# Altium schematic sheet AMU-S07-V00-AMSShutdown.SchDoc: Alarm Relay
size A3; DrawnBy: Thomas Benedetti; DocumentNumber: 7; SheetNumber: 7; SheetTotal: 25; Version: 00; Project: AMU 2020; PageSetup: Record=PageOptions|CenterHorizontal=True|CenterVertical=True|PrintScale=0.97|XCorrection=1.00|YCorrection=1.00|PrintKind=0|BorderSize=5000000|LeftOffset=0|BottomOffset=0|Orientation=2|PaperLength=1000|PaperWidth=1000|Scale=100|PaperSource=7|PrintQuality=-4|MediaType=1|DitherType=10|PaperKind=A4|PrintScaleMode=1
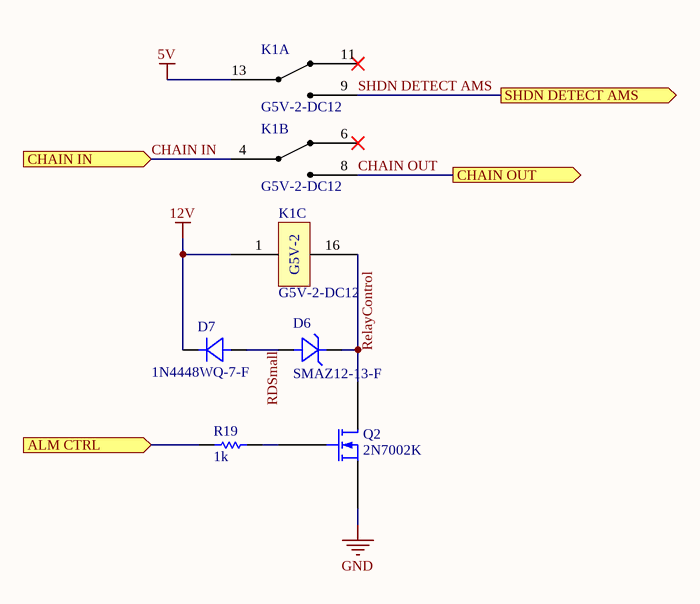
[diagram p0: AMU-S07-V00-AMSShutdown.SchDoc]

## Parts
D6  SMAZ12-13-F  [SMA]
D7  1N4448WQ-7-F  [SMA]
K1  G5V-2-DC12  [G5V-2]  (parts A,B,C of 3)
Q2  2N7002K  [SOT-23-3]
R19  1k  [Res_ThinFilm_0603]

## Ports
ALM CTRL (in), CHAIN IN (in), CHAIN OUT (out), SHDN DETECT AMS (out)

## Nets
5V: K1.13
12V: D7.K(Cathode) K1.1
GND: Q2.S
ALM CTRL: R19.1 ; port ALM CTRL
CHAIN IN: K1.4 ; port CHAIN IN
CHAIN OUT: K1.8 ; port CHAIN OUT
RDSmall: D6.A(Anode) D7.A(Anode)
RelayControl: D6.K(Cathode) K1.16 Q2.D
SHDN DETECT AMS: K1.9 ; port SHDN DETECT AMS
NetQ2_G: Q2.G R19.2

Not connected (* = marked no-connect by the designer): K1 6* 11*

## Notes on the sheet
- Revision History:
- Sheet Title:
- Rev
- Date
- Description
- Project:
- Size:
- Drawn By:
- A3
- Number:
- Revision:
- Sheet
- Version:
- of
- QUT Motorsport
- O-120, Gardens Point
- 2 George Street
- Brisbane, QLD 4000
- Australia
- Print Date:
- Print Time:
- File Name:
- (in symbol G5V-2-DC12, part C) G5V-2

## Library data of the parts
D6 = SMAZ12-13-F: Zener Diode 12V 1W ±5% Surface Mount SMA; Manufacturer: ON Semiconductor; MPN: MM3Z56VB; ComponentLink1Description: Digikey; ComponentLink1URL: https://www.digikey.com.au/product-detail/en/diodes-incorporated/SMAZ12-13-F/SMAZ12-FDICT-ND/725073; ComponentLink2Description: Datasheet; ComponentLink2URL: https://www.diodes.com/assets/Datasheets/ds18015.pdf
D7 = 1N4448WQ-7-F: Diode, SMD, 75V, 5%, 250mA, SOD123; Manufacturer: ON Semiconductor / Fairchild; Manufacturer Part Number: 1N914BWS; Average Rectified Current: 150mA; Element Configuration: Single; Forward Voltage: 1V; Max Reverse Leakage Current: 5uA; Power Dissipation: 200mW; Recovery Time: 4ns; Max Forward Surge Current (Ifsm): 4A; Parameter 1: *; Weight: 0.0276g; Category: Rectifier Diodes; Contact Plating: Tin,Matte; Forward Current: 150mA; Lead Free: Lead Free; Max Operating Temperature: 150°C; Max Repetitive Reverse Voltage (Vrrm): 75V; Max Reverse Voltage (DC): 75V; Min Operating Temperature: -55°C; Mount: Surface Mount; Number of Pins: 2; Package Quantity: 1; Packaging: Tape and Reel; Peak Reverse Current: 5uA; Radiation Hardening: No; REACH SVHC: No SVHC; Reverse Recovery Time: 4ns; Height: 1mm; Length: 1.8mm; Reverse Voltage: 75V; Width: 1.35mm
K1 = G5V-2-DC12: General Purpose Relay DPDT (2 Form C) Through Hole, 12V, 2A
Q2 = 2N7002K: N-Channel 60V 300mA (Ta) 350mW (Ta) Surface Mount SOT-23 (TO-236AB)
R19 = 1k 5% 0603: Resistor, SMD, 1k, 0.1W, 5%, 0603